# Altium schematic sheet 11_ethernet.SchDoc
size A4; SheetNumber: 13; SheetTotal: 13
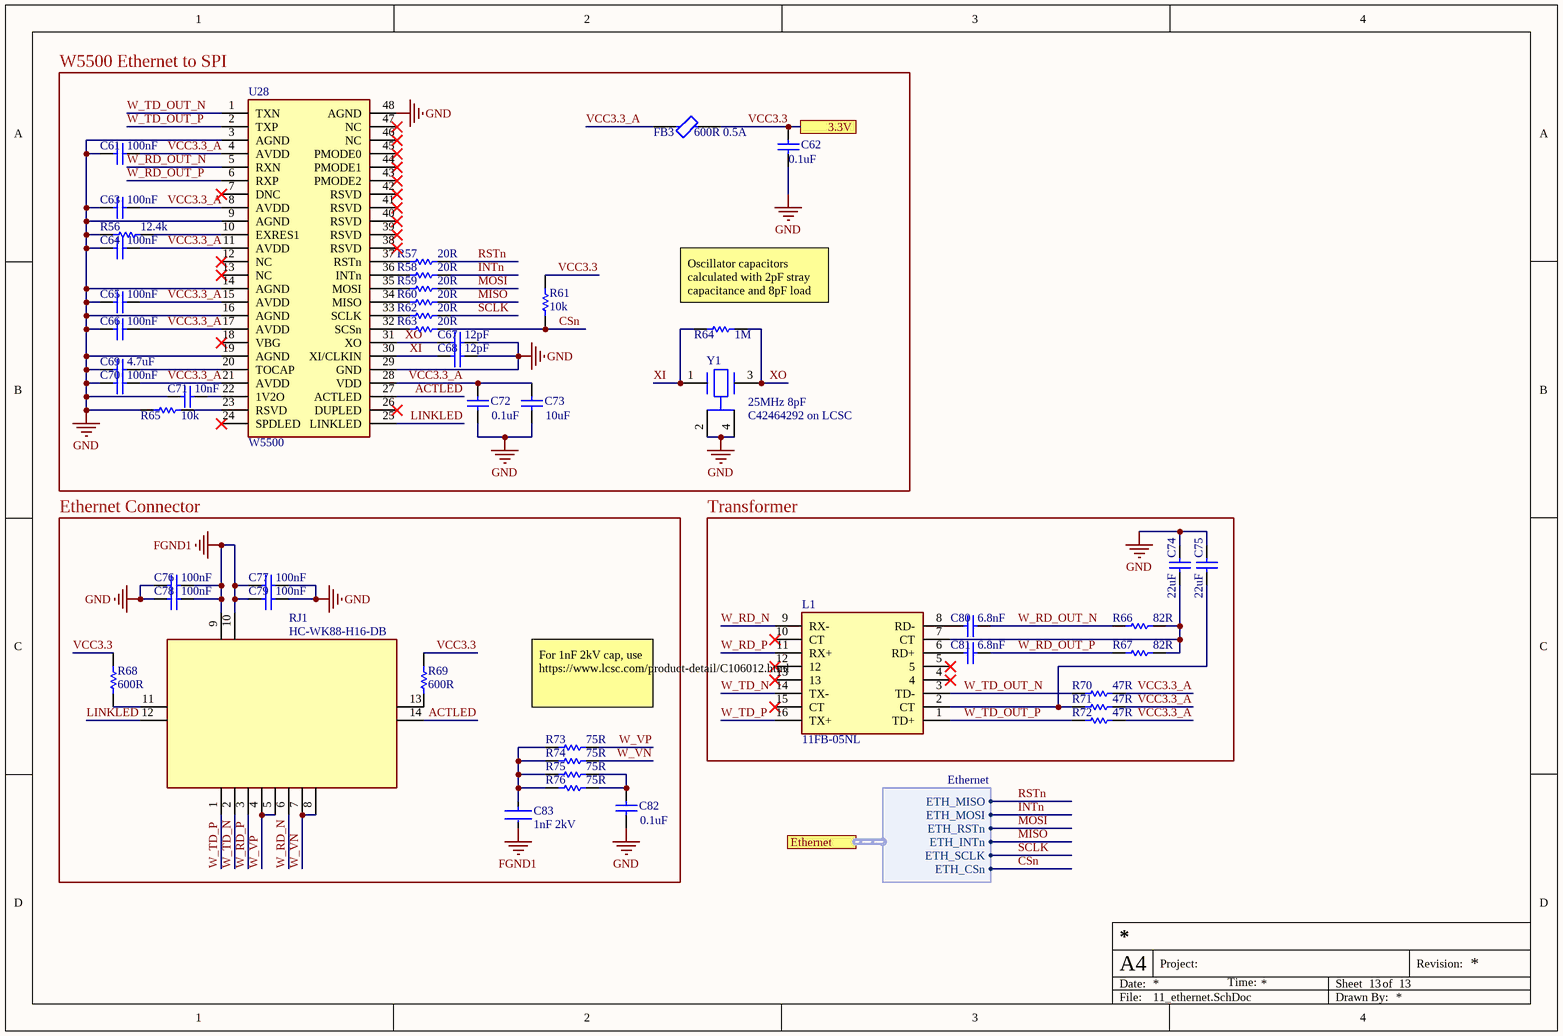
[diagram p0: 11_ethernet.SchDoc]

## Parts
C61  100nF  [CAPC1609X100X15NL20]
C62  0.1uF  [CAPC1609X100X15NL20]
C63  100nF  [CAPC1609X100X15NL20]
C64  100nF  [CAPC1609X100X15NL20]
C65  100nF  [CAPC1609X100X15NL20]
C66  100nF  [CAPC1609X100X15NL20]
C67  12pF  [CAPC1609X100X15NL20]
C68  12pF  [CAPC1609X100X15NL20]
C69  4.7uF  [CAPC1609X100X15NL20]
C70  100nF  [CAPC1609X100X15NL20]
C71  10nF  [CAPC1609X100X15NL20]
C72  0.1uF  [CAPC1609X100X15NL20]
C73  10uF  [CAPC1609X100X15NL20]
C74  22uF  [CAPC1609X100X15NL20]
C75  22uF  [CAPC1609X100X15NL20]
C76  100nF  [CAPC1609X100X15NL20]
C77  100nF  [CAPC1609X100X15NL20]
C78  100nF  [CAPC1609X100X15NL20]
C79  100nF  [CAPC1609X100X15NL20]
C80  6.8nF  [CAPC1609X100X15NL20]
C81  6.8nF  [CAPC1609X100X15NL20]
C82  0.1uF  [CAPC1609X100X15NL20]
C83  1nF 2kV  [FP-C1206X102KGRACAUTO-MFG]
FB3  600R 0.5A  [FP-MMZ1608-0_8-IPC_A]
L1  11FB-05NL  [XFMR-SMD_11FB-05NL]
R56  12.4k  [RESC1609X55X30NL10T20]
R57  20R  [RESC1609X55X30NL10T20]
R58  20R  [RESC1609X55X30NL10T20]
R59  20R  [RESC1609X55X30NL10T20]
R60  20R  [RESC1609X55X30NL10T20]
R61  10k  [RESC1609X55X30NL10T20]
R62  20R  [RESC1609X55X30NL10T20]
R63  20R  [RESC1609X55X30NL10T20]
R64  1M  [RESC1609X55X30NL10T20]
R65  10k  [RESC1609X55X30NL10T20]
R66  82R  [RESC1609X55X30NL10T20]
R67  82R  [RESC1609X55X30NL10T20]
R68  600R  [RESC1609X55X30NL10T20]
R69  600R  [RESC1609X55X30NL10T20]
R70  47R  [RESC1609X55X30NL10T20]
R71  47R  [RESC1609X55X30NL10T20]
R72  47R  [RESC1609X55X30NL10T20]
R73  75R  [RESC1609X55X30NL10T20]
R74  75R  [RESC1609X55X30NL10T20]
R75  75R  [RESC1609X55X30NL10T20]
R76  75R  [RESC1609X55X30NL10T20]
RJ1  HC-WK88-H16-DB  [RJ45-TH_HC-WK88-H16-DB]
U28  W5500  [LQFP-48_L7.0-W7.0-P0.50-LS9.0-BL]
Y1  25MHz 8pF  [FP-NX3225SA-MFG]

## Blocks framed on the sheet
W5500 Ethernet to SPI: C61-C73 FB3 R56-R65 U28 Y1
Ethernet Connector: C76-C79 C82 C83 R68 R69 R73-R76 RJ1
Transformer: C74 C75 C80 C81 L1 R66 R67 R70-R72

## Ports
3.3V, Ethernet (harness Ethernet)

## Harnesses
Ethernet: ETH_MISO, ETH_MOSI, ETH_INTn, ETH_CSn, ETH_SCLK, ETH_RSTn

## Nets
FGND1: C76.1 C77.2 C78.1 C79.2 C83.2 RJ1.9 RJ1.10
GND: C61.2 C62.1 C63.2 C64.2 C65.2 C66.2 C67.1 C68.1 C69.2 C70.2 C71.2 C72.1 C73.1 C74.1 C75.1 C76.2 C77.1 C78.2 C79.1 C82.1 R56.2 R65.2 U28.3(AGND) U28.9(AGND) U28.14(AGND) U28.16(AGND) U28.19(AGND) U28.29(GND) U28.48(AGND) Y1.2(GND) Y1.4(GND)
ACTLED: RJ1.14(-) U28.27(ACTLED)
CSn: R61.2 R63.1 ; port Ethernet.ETH_CSn
INTn: R58.1 ; port Ethernet.ETH_MOSI
LINKLED: RJ1.12(-) U28.25(LINKLED)
MISO: R60.1 ; port Ethernet.ETH_INTn
MOSI: R59.1 ; port Ethernet.ETH_RSTn
RSTn: R57.1 ; port Ethernet.ETH_MISO
SCLK: R62.1 ; port Ethernet.ETH_SCLK
VCC3.3: C62.2 FB3.2 R61.1 R68.2 R69.2 ; port 3.3V
VCC3.3_A: C61.1 C63.1 C64.1 C65.1 C66.1 C70.1 C72.2 C73.2 FB3.1 R70.1 R71.1 R72.1 U28.4(AVDD) U28.8(AVDD) U28.11(AVDD) U28.15(AVDD) U28.17(AVDD) U28.21(AVDD) U28.28(VDD)
W_RD_N: L1.9(RX-) RJ1.6
W_RD_OUT_N: C80.1 R66.2 U28.5(RXN)
W_RD_OUT_P: C81.1 R67.2 U28.6(RXP)
W_RD_P: L1.11(RX+) RJ1.3
W_TD_N: L1.14(TX-) RJ1.2
W_TD_OUT_N: L1.3(TD-) R70.2 U28.1(TXN)
W_TD_OUT_P: L1.1(TD+) R72.2 U28.2(TXP)
W_TD_P: L1.16(TX+) RJ1.1
W_VN: R74.1 RJ1.7 RJ1.8
W_VP: R73.1 RJ1.4 RJ1.5
XI: C68.2 R64.2 U28.30(XI/CLKIN) Y1.1
XO: C67.2 R64.1 U28.31(XO) Y1.3
NetC69_1: C69.1 U28.20(TOCAP)
NetC71_1: C71.1 U28.22(1V2O)
NetC74_2: C74.2 L1.7(CT) R66.1 R67.1
NetC75_2: C75.2 L1.2(CT) R71.2
NetC80_2: C80.2 L1.8(RD-)
NetC81_2: C81.2 L1.6(RD+)
NetC82_2: C82.2 R75.1 R76.1
NetC83_1: C83.1 R73.2 R74.2 R75.2 R76.2
NetR56_1: R56.1 U28.10(EXRES1)
NetR57_2: R57.2 U28.37(RSTn)
NetR58_2: R58.2 U28.36(INTn)
NetR59_2: R59.2 U28.35(MOSI)
NetR60_2: R60.2 U28.34(MISO)
NetR62_2: R62.2 U28.33(SCLK)
NetR63_2: R63.2 U28.32(SCSn)
NetR65_1: R65.1 U28.23(RSVD)
NetR68_1: R68.1 RJ1.11(+)
NetR69_1: R69.1 RJ1.13(+)

Not connected (* = marked no-connect by the designer): L1 4* 5* 10(CT)* 12* 13* 15(CT)*; U28 7(DNC)* 12(NC)* 13(NC)* 18(VBG)* 24(SPDLED)* 26(DUPLED)* 38(RSVD)* 39(RSVD)* 40(RSVD)* 41(RSVD)* 42(RSVD)* 43(PMODE2)* 44(PMODE1)* 45(PMODE0)* 46(NC)* 47(NC)*

## Notes on the sheet
- (near R64) Oscillator capacitors calculated with 2pF stray capacitance and 8pF load
- (near Y1) C42464292 on LCSC
- For 1nF 2kV cap, use https://www.lcsc.com/product-detail/C106012.html
- Date:
- A4
- Project:
- Time:
- Sheet
- of
- Revision:
- File:
- Drawn By:

## Library data of the parts
C61-C82 = CMP-2006-00183-1: Manufacturer: AVX Interconnect / Elco; Part Number: TACL105K006XTA
C83 = CMP-03020-034685-1: CAP CER 1206 1NF 2000V X7R 10% F; Case/Package: 1206; RoHS Compliant: Yes; Max Operating Temperature: 125°C; Capacitance: 1nF; Features: Soft Termination; Mount: Surface Mount; Voltage Rating: 2kV; Case Code (Metric): 3216; Ratings: AEC-Q200; Case Code (Imperial): 1206; Packaging: Cut Tape; Tolerance: 10%; Min Operating Temperature: -55°C
FB3 = CMP-08257-000171-1: Signal Line Ferrite Bead 600Ω  @ 100MHz 500mA DCR 400mΩ SMD 0603; Tolerance: 25%; DC Resistance (DCR): 400mR; REACH SVHC: No SVHC; RoHS Compliant: Yes; Case Code (Metric): 1608; Current Rating: 500mA; Package Quantity: 1; Width: 0.031inch; Number of Pins: 2; Case/Package: 0603; Case Code (Imperial): 0603; Packaging: Tape and Reel; Max DC Current: 500mA; Length: 0.063inch; Impedance: 600R; Mount: Surface Mount; Series: MMZ; Height: 0.037inch; Core Material: Ferrite
L1 = 11FB-05NL: Turns Ratio: rate:10/100 Base-T Inductance:350uH Isolation Voltage(Vrms):1.5kV operating temperature:-40℃~+85℃ operating temperature:-40℃~+85℃; Manufacturer: YDS(元册科技); Value: 350uH; Isolation Voltage(Vrms): 1.5kV; LCSC Part Name: 10/100BASE-T单端口表面贴装磁器件; Supplier Part: C97692; Manufacturer Part: 11FB-05NL; Supplier Footprint: SMD-16P,12.8x6.9mm; JLCPCB Part Class: Extended Part; Datasheet: https://item.szlcsc.com/datasheet/11FB-05NL/98900.html; Supplier: LCSC; rate: 10/100 Base-T; operating temperature: -40℃~+85℃
R56-R76 = CMP-2000-03692-1: Manufacturer: Vishay Dale; Part Number: TNPW060310K0BEEN
RJ1 = HC-WK88-H16-DB: Connector Type:RJ45 Jack Mounting Type:Right Angle Number of Ports:1 LED:With LED Shielding:Shielded Ratings:- PoE:- Supplementary Features:- Contact Material:Copper Contact Plating:Gold Operating Temperature:-25℃~+70℃ Operating Temperature:-25℃~+70℃; Manufacturer: HC(虹成电子); Number of Ports: 1; LCSC Part Name: 弯插 带LED 网口 RJ45-8P8C-16H半包 带灯 不锈钢壳 B款; Supplier Part: C7501824; Manufacturer Part: HC-WK88-H16-DB; Supplier Footprint: 插件; JLCPCB Part Class: Extended Part; Datasheet: https://item.szlcsc.com/datasheet/HC-WK88-H16-DB/8585365.html; Supplier: LCSC; Connector Type: RJ45 Jack; Mounting Type: Right Angle; LED: With LED; Shielding: Shielded; Contact Material: Copper; Contact Plating: Gold; Operating Temperature: -25℃~+70℃
U28 = W5500: Number of Channels:8 MAC Interface:SPI Voltage - Supply:3.3V Voltage - Supply:3.3V Integrated PHY:Yes Operating Temperature:-40℃~+85℃ Operating Temperature:-40℃~+85℃ Communication Interface:SPI Memory Space:32KB Ethernet Speed Standards:10BASE-T；100BASE-T; Manufacturer: WIZNET; Number of Channels: 8; MAC Interface: SPI; Voltage - Supply: 3.3V; Integrated PHY: Yes; Memory Space: 32KB; Ethernet Speed Standards: 10BASE-T；100BASE-TX; LCSC Part Name: W5500硬连线TCP/IP嵌入式以太网控制器; Supplier Part: C32843; Manufacturer Part: W5500; Supplier Footprint: LQFP-48(7x7); JLCPCB Part Class: Extended Part; Datasheet: https://item.szlcsc.com/datasheet/W5500/33808.html; Supplier: LCSC; Operating Temperature: -40℃~+85℃; Communication Interface: SPI
Y1 = CMP-200220-000002-1: CRYSTAL 25.0000MHZ 8PF SMD; Manufacturer Part Number: NX3225SA-25.000M-STD-CRS-2; Manufacturer: NDK; Automotive Grade: Grade 1; Esr: 100Ω; Tolerance: 15ppm; Frequency: 25MHz; Digikey Description: CRYSTAL 25.0000MHZ 8PF SMD; Temperature Range Low: -40°C; Octopart: https://octopart.com/nx3225sa-25.000m-std-crs-2-ndk-51374293; Series: NX3225SA; ComponentLink2URL: https://www.ndk.com/images/products/catalog/c_NX3225SA-STD-CRS-2_e.pdf; Lead Free: Yes; Device Class L2: Crystals / Oscillators; ComponentLink2Description: Datasheet; Device Class L3: Crystals; Category: Crys; Device Class L1: Passive Components; Automotive: Yes; RoHS: TRUE; Load Capacitance: 8pF; Height: 0.6mm; Temperature Range High: +125°C; Package: NX3225SA; Temperature: -40°C to +125°C